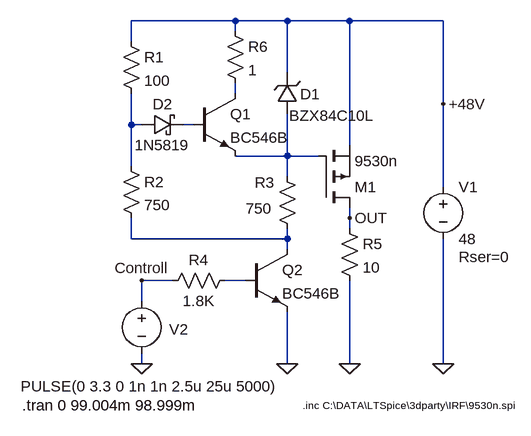
[diagram p0: schematic driver_v1_resistive.asc]
driver_v1_resistive.asc, the LTspice schematic file:
Version 4
SHEET 1 908 680
WIRE 336 -128 176 -128
WIRE 416 -128 336 -128
WIRE 512 -128 416 -128
WIRE 656 -128 512 -128
WIRE 336 -112 336 -128
WIRE 176 -96 176 -128
WIRE 416 -48 416 -128
WIRE 336 -16 336 -32
WIRE 656 0 656 -128
WIRE 176 32 176 -16
WIRE 192 32 176 32
WIRE 272 32 256 32
WIRE 512 64 512 -128
WIRE 416 80 416 16
WIRE 416 80 336 80
WIRE 464 80 416 80
WIRE 176 96 176 32
WIRE 416 112 416 80
WIRE 656 128 656 0
WIRE 512 176 512 160
WIRE 512 192 512 176
WIRE 176 208 176 176
WIRE 416 208 416 192
WIRE 416 208 176 208
WIRE 416 224 416 208
WIRE 240 272 192 272
WIRE 352 272 320 272
WIRE 192 304 192 272
WIRE 192 400 192 384
WIRE 416 400 416 320
WIRE 512 400 512 272
WIRE 656 400 656 208
FLAG 416 400 0
FLAG 512 400 0
FLAG 656 400 0
FLAG 192 400 0
FLAG 656 0 +48V
FLAG 192 272 Controll
FLAG 512 176 OUT
SYMBOL pmos 464 160 M180
SYMATTR InstName M1
SYMATTR Value 9530n
SYMATTR Prefix X
SYMBOL zener 432 16 R180
WINDOW 0 -35 31 Left 2
WINDOW 3 -118 -2 Left 2
SYMATTR InstName D1
SYMATTR Value BZX84C10L
SYMBOL schottky 192 48 R270
WINDOW 0 32 32 VTop 2
WINDOW 3 0 32 VBottom 2
SYMATTR InstName D2
SYMATTR Value 1N5819
SYMATTR Description Diode
SYMATTR Type diode
SYMBOL npn 272 -16 R0
SYMATTR InstName Q1
SYMATTR Value BC546B
SYMBOL npn 352 224 R0
SYMATTR InstName Q2
SYMATTR Value BC546B
SYMBOL res 160 -112 R0
SYMATTR InstName R1
SYMATTR Value 100
SYMBOL res 160 80 R0
SYMATTR InstName R2
SYMATTR Value 750
SYMBOL res 400 96 R0
WINDOW 0 -34 25 Left 2
WINDOW 3 -48 65 Left 2
SYMATTR InstName R3
SYMATTR Value 750
SYMATTR SpiceLine pwr=2
SYMBOL res 336 256 R90
WINDOW 0 0 56 VBottom 2
WINDOW 3 32 56 VTop 2
SYMATTR InstName R4
SYMATTR Value 1.8K
SYMBOL res 496 176 R0
SYMATTR InstName R5
SYMATTR Value 10
SYMBOL voltage 656 112 R0
WINDOW 123 0 0 Left 2
WINDOW 39 24 124 Left 2
SYMATTR SpiceLine Rser=0
SYMATTR InstName V1
SYMATTR Value 48
SYMBOL voltage 192 288 R0
WINDOW 0 42 59 Left 2
WINDOW 3 -186 147 Left 2
WINDOW 123 0 0 Left 2
WINDOW 39 0 0 Left 2
SYMATTR InstName V2
SYMATTR Value PULSE(0 3.3 0 1n 1n 2.5u 25u 5000)
SYMBOL res 320 -128 R0
SYMATTR InstName R6
SYMATTR Value 1
TEXT 440 464 Left 1 !.inc C:\\DATA\\LTSpice\\3dparty\\IRF\\9530n.spi
TEXT 8 464 Left 2 !.tran 0 99.004m 98.999m

The netlist it stands for:
* driver_v1_resistive.asc
XM1 OUT N004 +48V 9530n  ; pins D G S
D1 N004 +48V BZX84C10L
D2 N002 N003 1N5819
Q1 N001 N003 N004 0 BC546B
Q2 N005 N006 0 0 BC546B
R1 +48V N002 100
R2 N002 N005 750
R3 N004 N005 750 pwr=2
R4 N006 Controll 1.8K
R5 OUT 0 10
V1 +48V 0 48 Rser=0
V2 Controll 0 PULSE(0 3.3 0 1n 1n 2.5u 25u 5000)
R6 +48V N001 1
.model D D
.lib standard.dio
.model NPN NPN
.model PNP PNP
.lib standard.bjt
.inc C:\DATA\LTSpice\3dparty\IRF\9530n.spi
.tran 0 99.004m 98.999m
.backanno
.end